# Altium schematic sheet can.SchDoc
size A; SheetNumber: 1; SheetTotal: 1
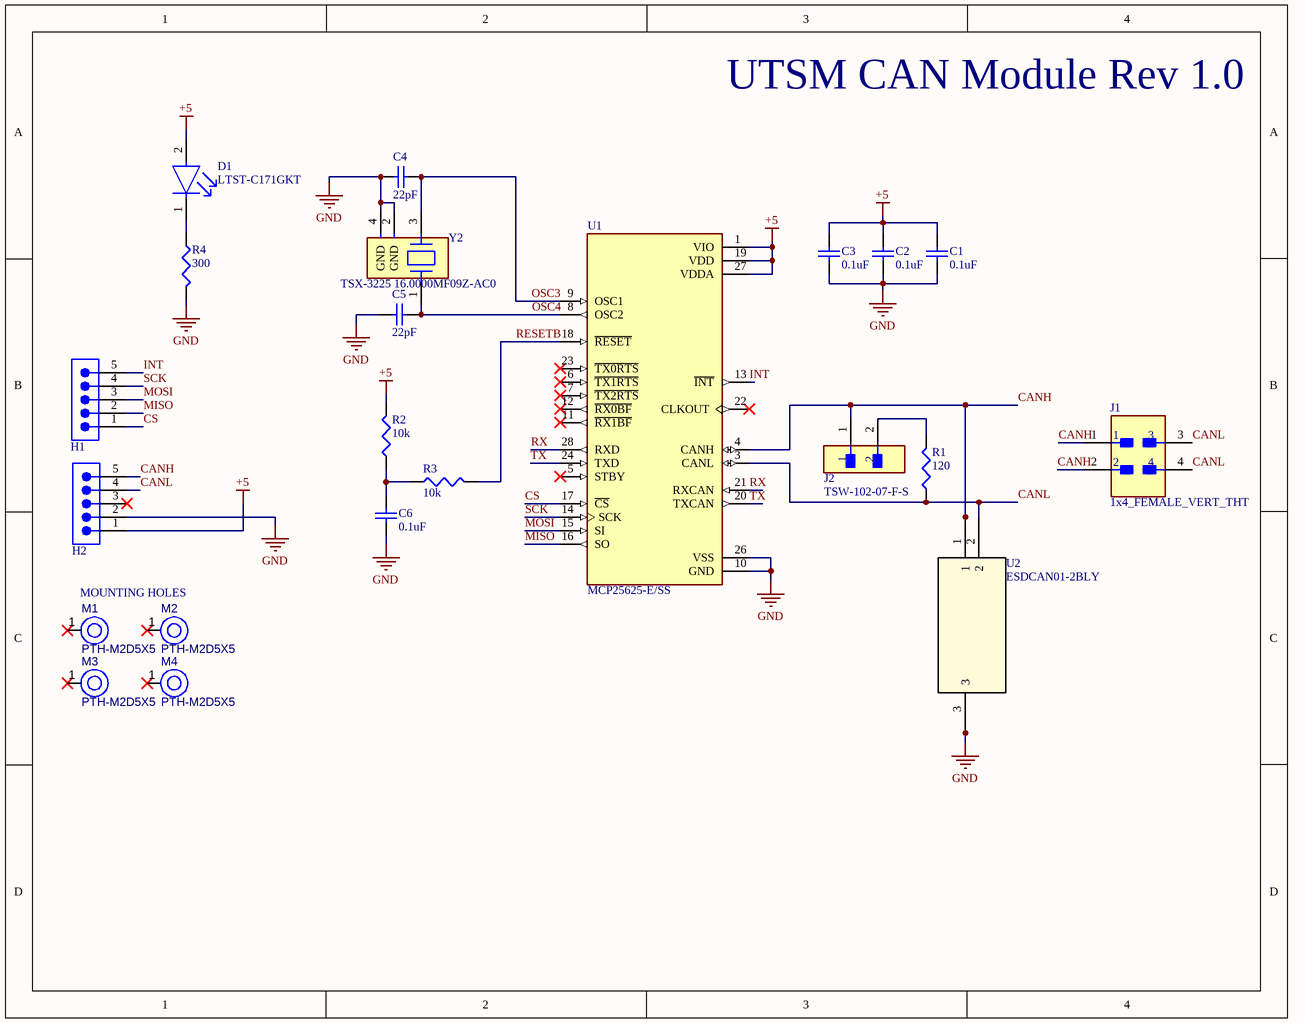
[diagram p0: can.SchDoc]

## Parts
C1  value 0.1uF  [0603c]  (hidden comment: Cap)
C2  value 0.1uF  [0603c]  (hidden comment: Cap)
C3  value 0.1uF  [0603c]  (hidden comment: Cap)
C4  value 22pF  [0603c]
C5  value 22pF  [0603c]  (hidden comment: Cap)
C6  value 0.1uF  [0603c]  (hidden comment: Cap)
D1  LTST-C171GKT  [FP-LTST-C171GKT-MFG]
H1  61300511121  [61300511121]  (value not drawn)
H2  61300511121  [61300511121]  (value not drawn)
J1  1x4_FEMALE_VERT_THT  [FP-0039281043-MFG]
J2  TSW-102-07-F-S  [FP-TSW-102-07-F-S-MFG]
M1  PTH-M2D5X5  [PTH-M2D5X5]
M2  PTH-M2D5X5  [PTH-M2D5X5]
M3  PTH-M2D5X5  [PTH-M2D5X5]
M4  PTH-M2D5X5  [PTH-M2D5X5]
R1  value 120  [0603r]  (hidden comment: Res3)
R2  value 10k  [0603r]  (hidden comment: Res3)
R3  value 10k  [0603r]  (hidden comment: Res3)
R4  value 300  [0603r]  (hidden comment: Res3)
U1  MCP25625-E/SS  [SOP65P780X200-28N]
U2  ESDCAN01-2BLY  [SOT_01-2BLY_STM]
Y2  TSX-3225 16.0000MF09Z-AC0  [FP-TSX-3225-MFG]

## Nets
+5: C1.2 C2.2 C3.2 D1.2(A) H2.1 R2.2 U1.1(VIO) U1.19(VDD) U1.27(VDDA)
GND: C1.1 C2.1 C3.1 C4.1 C5.1 C6.1 H2.2 R4.2 U1.10(GND) U1.26(VSS) U2.3 Y2.2(GND) Y2.4(GND)
CANH: H2.5 J1.1 J1.2 J2.1 U1.4(CANH) U2.1
CANL: H2.4 J1.3 J1.4 R1.1 U1.3(CANL) U2.2
CS: H1.1 U1.17(~{CS})
INT: H1.5 U1.13(~{INT})
MISO: H1.2 U1.16(SO)
MOSI: H1.3 U1.15(SI)
OSC3: C4.2 U1.9(OSC1) Y2.3
OSC4: C5.2 U1.8(OSC2) Y2.1
RESETB: R3.2 U1.18(~{RESET})
RX: U1.21(RXCAN) U1.28(RXD)
SCK: H1.4 U1.14(SCK)
TX: U1.20(TXCAN) U1.24(TXD)
NetC6_2: C6.2 R2.1 R3.1
NetD1_1: D1.1(C) R4.1
NetJ2_2: J2.2 R1.2

Not connected (* = marked no-connect by the designer): H2 3*; M1 1(H1)*; M2 1(H1)*; M3 1(H1)*; M4 1(H1)*; U1 5(STBY)* 6(~{TX1RTS})* 7(~{TX2RTS})* 11(~{RX1BF})* 12(~{RX0BF})* 22(CLKOUT)* 23(~{TX0RTS})*

## Notes on the sheet
- UTSM CAN Module Rev 1.0
- MOUNTING HOLES

## Library data of the parts
C1 C4 = Cap: 0603 Capacitor; Published: 8-Jun-2000; LatestRevisionDate: 17-Jul-2002; LatestRevisionNote: Re-released for DXP Platform.; PackageReference: RAD-0.3; Publisher: Altium Limited; PackageDescription: Radial Cap, Thru-Hole; 2 Leads; 0.3 in Pin Spacing
C2 C3 C5 C6 = Cap: SMD Capacitor; Published: 8-Jun-2000; LatestRevisionDate: 17-Jul-2002; LatestRevisionNote: Re-released for DXP Platform.; PackageReference: RAD-0.3; Publisher: Altium Limited; PackageDescription: Radial Cap, Thru-Hole; 2 Leads; 0.3 in Pin Spacing
D1 = CMP-22017-000007-1: LED GREEN CLEAR CHIP SMD; Luminous Intensity: 12mcd; Lens Color: Colorless; Dominant Wavelength: 569nm; Number of LEDs: 1; Power Dissipation: 100mW; Viewing Angle: 130°; Reverse Voltage: 5V; Test Current: 10mA; Forward Voltage: 2.1V; Wavelength: 585nm; Lens Style: Diffused; Forward Current: 30mA; Height: 0.8mm; Mount: Surface Mount; Package Quantity: 1; Length: 2mm; Case Code (Metric): 2012; Number of Pins: 2; Number of Elements: 1; Packaging: Tape and Reel; Color: Green; Min Operating Temperature: -55°C; Case/Package: 0805; Power Rating: 100mW; Max Operating Temperature: 85°C; Radiation Hardening: No; Depth: 1.25mm; Lens Transparency: Clear; Width: 1.25mm; Lead Free: Lead Free; Case Code (Imperial): 0805; Illumination Color: Green
H1 H2 = 61300511121: WR-PHD Pin Header, THT, Vertical, pitch 2.54mm, 1 Row, 5P; Manufacturer: Wurth Elektronik; Contact Resistance: 20mOhm; Rated Current: 3A; Working Voltage: 250V; Withstanding Voltage: 500V; Manufacturer Part Number: 61300511121; Category: Board-to-Board Connectors; Match Code: WR-PHD; ComponentLink1Description: Website Link; ComponentLink1URL: https://www.we-online.com/redexpert/article/61300511121?ad; ComponentLink2Description: Datasheet Link; ComponentLink2URL: https://www.we-online.com/redexpert/spec/61300511121?ad; Mount: Through Hole; Operating Temperature Max: 105°C; Operating Temperature Min: -40°C; Packaging: Bag; Gender: Pin Header; Number of Pins: 5; Number of Rows: 1; Orientation: Vertical; Pitch: 2.54mm
J1 = 1x4_FEMALE_POWER: CONN HEADER VERT 4POS 4.2MM. 0039281043; Manufacturer: Molex; Conn Orientation: Vertical; Conn Gender: Male; Current Rating: 9A; Voltage Rating: 600V; Number Of Contacts: 4; Pitch: 4.2mm; Manufacturer Part Number: 0039281043; Lead Free: Yes; Category: Conn; Height: 13.1mm; ComponentLink2URL: https://www.molex.com/webdocs/datasheets/pdf/en-us/0039281043_PCB_HEADERS.pdf; Package: 0; Device Class L2: Headers and Wire Housings; Contact Material: Tin; Footprint Url: https://www.molex.com/pdm_docs/sd/039281043_sd.pdf; Device Class L1: Connectors; Temperature Range High: +105°C; Automotive: No; RoHS: TRUE; Temperature: -40°C to +105°C; Number Of Rows: 2; Digikey Description: CONN HEADER VERT 4POS 4.2MM; Temperature Range Low: -40°C; Octopart: https://octopart.com/39-28-1043-molex-7613; Device Class L3: unset; ComponentLink2Description: Datasheet
J2 = CMP-02766-001458-1: CONN HEADER VERT 2POS 2.54MM; Gender: Male; Max Current Rating: 7.6A; Number of Contacts: 2; Max Voltage Rating (AC): 550V; Orientation: Straight; Depth: 2.54mm; Series: TSW; Package Quantity: 1; Min Operating Temperature: -55°C; Max Operating Temperature: 125°C; Contact Type: Male Pin; Contact Shape: Square; Color: Black; Housing Color: Black; Connector Type: Header; Fastening Type: Pull; Radiation Hardening: No; Pitch: 2.54mm; Housing Material: Polyester; Mount: Through Hole; Number of Positions: 2; Number of Rows: 1; Contact Material: Bronze; Insulation Color: Black; Contact Finish - Mating: GOLD; Termination: Solder; Insulation Material: PBT; Length: 5.08mm; Flammability Rating: UL94 V-0; Contact Mating Length: 0.23inch; REACH SVHC: No SVHC; Contact Plating: Gold; RoHS Compliant: Yes; Packaging: Bulk
M1-M4 = PTH-M2D5X5: M2 PTH (2.5mm), 5mm pad; Pins: 1; Component Type: Mechanical
R1-R4 = Res3: SMD Resistor; Published: 8-Jun-2000; LatestRevisionDate: 29-May-2009; LatestRevisionNote: IPC-7351 Footprint Added.; PackageReference: J1-0603; Publisher: Altium Limited; PackageDescription: Chip Resistor
U1 = MCP25625-E/SS: 1/1 Transceiver CANbus 28-SSOP; MF: Microchip; Package: SSOP-28 Microchip; Availability: Unavailable; MP: MCP25625-E/SS; Value: *; SnapEDA_Link: https://www.snapeda.com/parts/MCP25625-E/SS/Microchip/view-part/51329/?ref=snap; Price: None
U2 = ESDCAN01-2BLY: Mfr_Name: STMicroelectronics; Copyright: Copyright (C) 2023 Ultra Librarian. All rights reserved.; Manufacturer_Part_Number: ESDCAN01-2BLY; RefDes: RefDes; Type: DEV
Y2 = CMP-36405-000014-1: CRYSTAL 16.0000MHZ 9PF SMD; Tolerance: 10ppm; Frequency: 16MHz; Drive Level: 200uW; Frequency Stability: 9ppm; ESR (Equivalent Series Resistance): 60R; Min Operating Temperature: -20°C; Packaging: Tape and Reel; Lead Free: Lead Free; Mount: Surface Mount; Width: 0.098inch; Length: 0.126inch; Weight: 0.000564oz; Max Operating Temperature: 75°C; Frequency Tolerance: 10ppm; Case/Package: SMD/SMT; Height: 0.024inch; Termination: SMD/SMT; Package Quantity: 1000; Load Capacitance: 9pF; RoHS Compliant: Yes; Series: TSX-3225